# EasyEDA schematic T1_Schematic_RohanKumar_B24277.json
TITLE: Sheet_1; REV: 1.0; Date: 2025-07-06; Sheet: 1/1; Drawn By: rohankumar84342; Company: Your Company
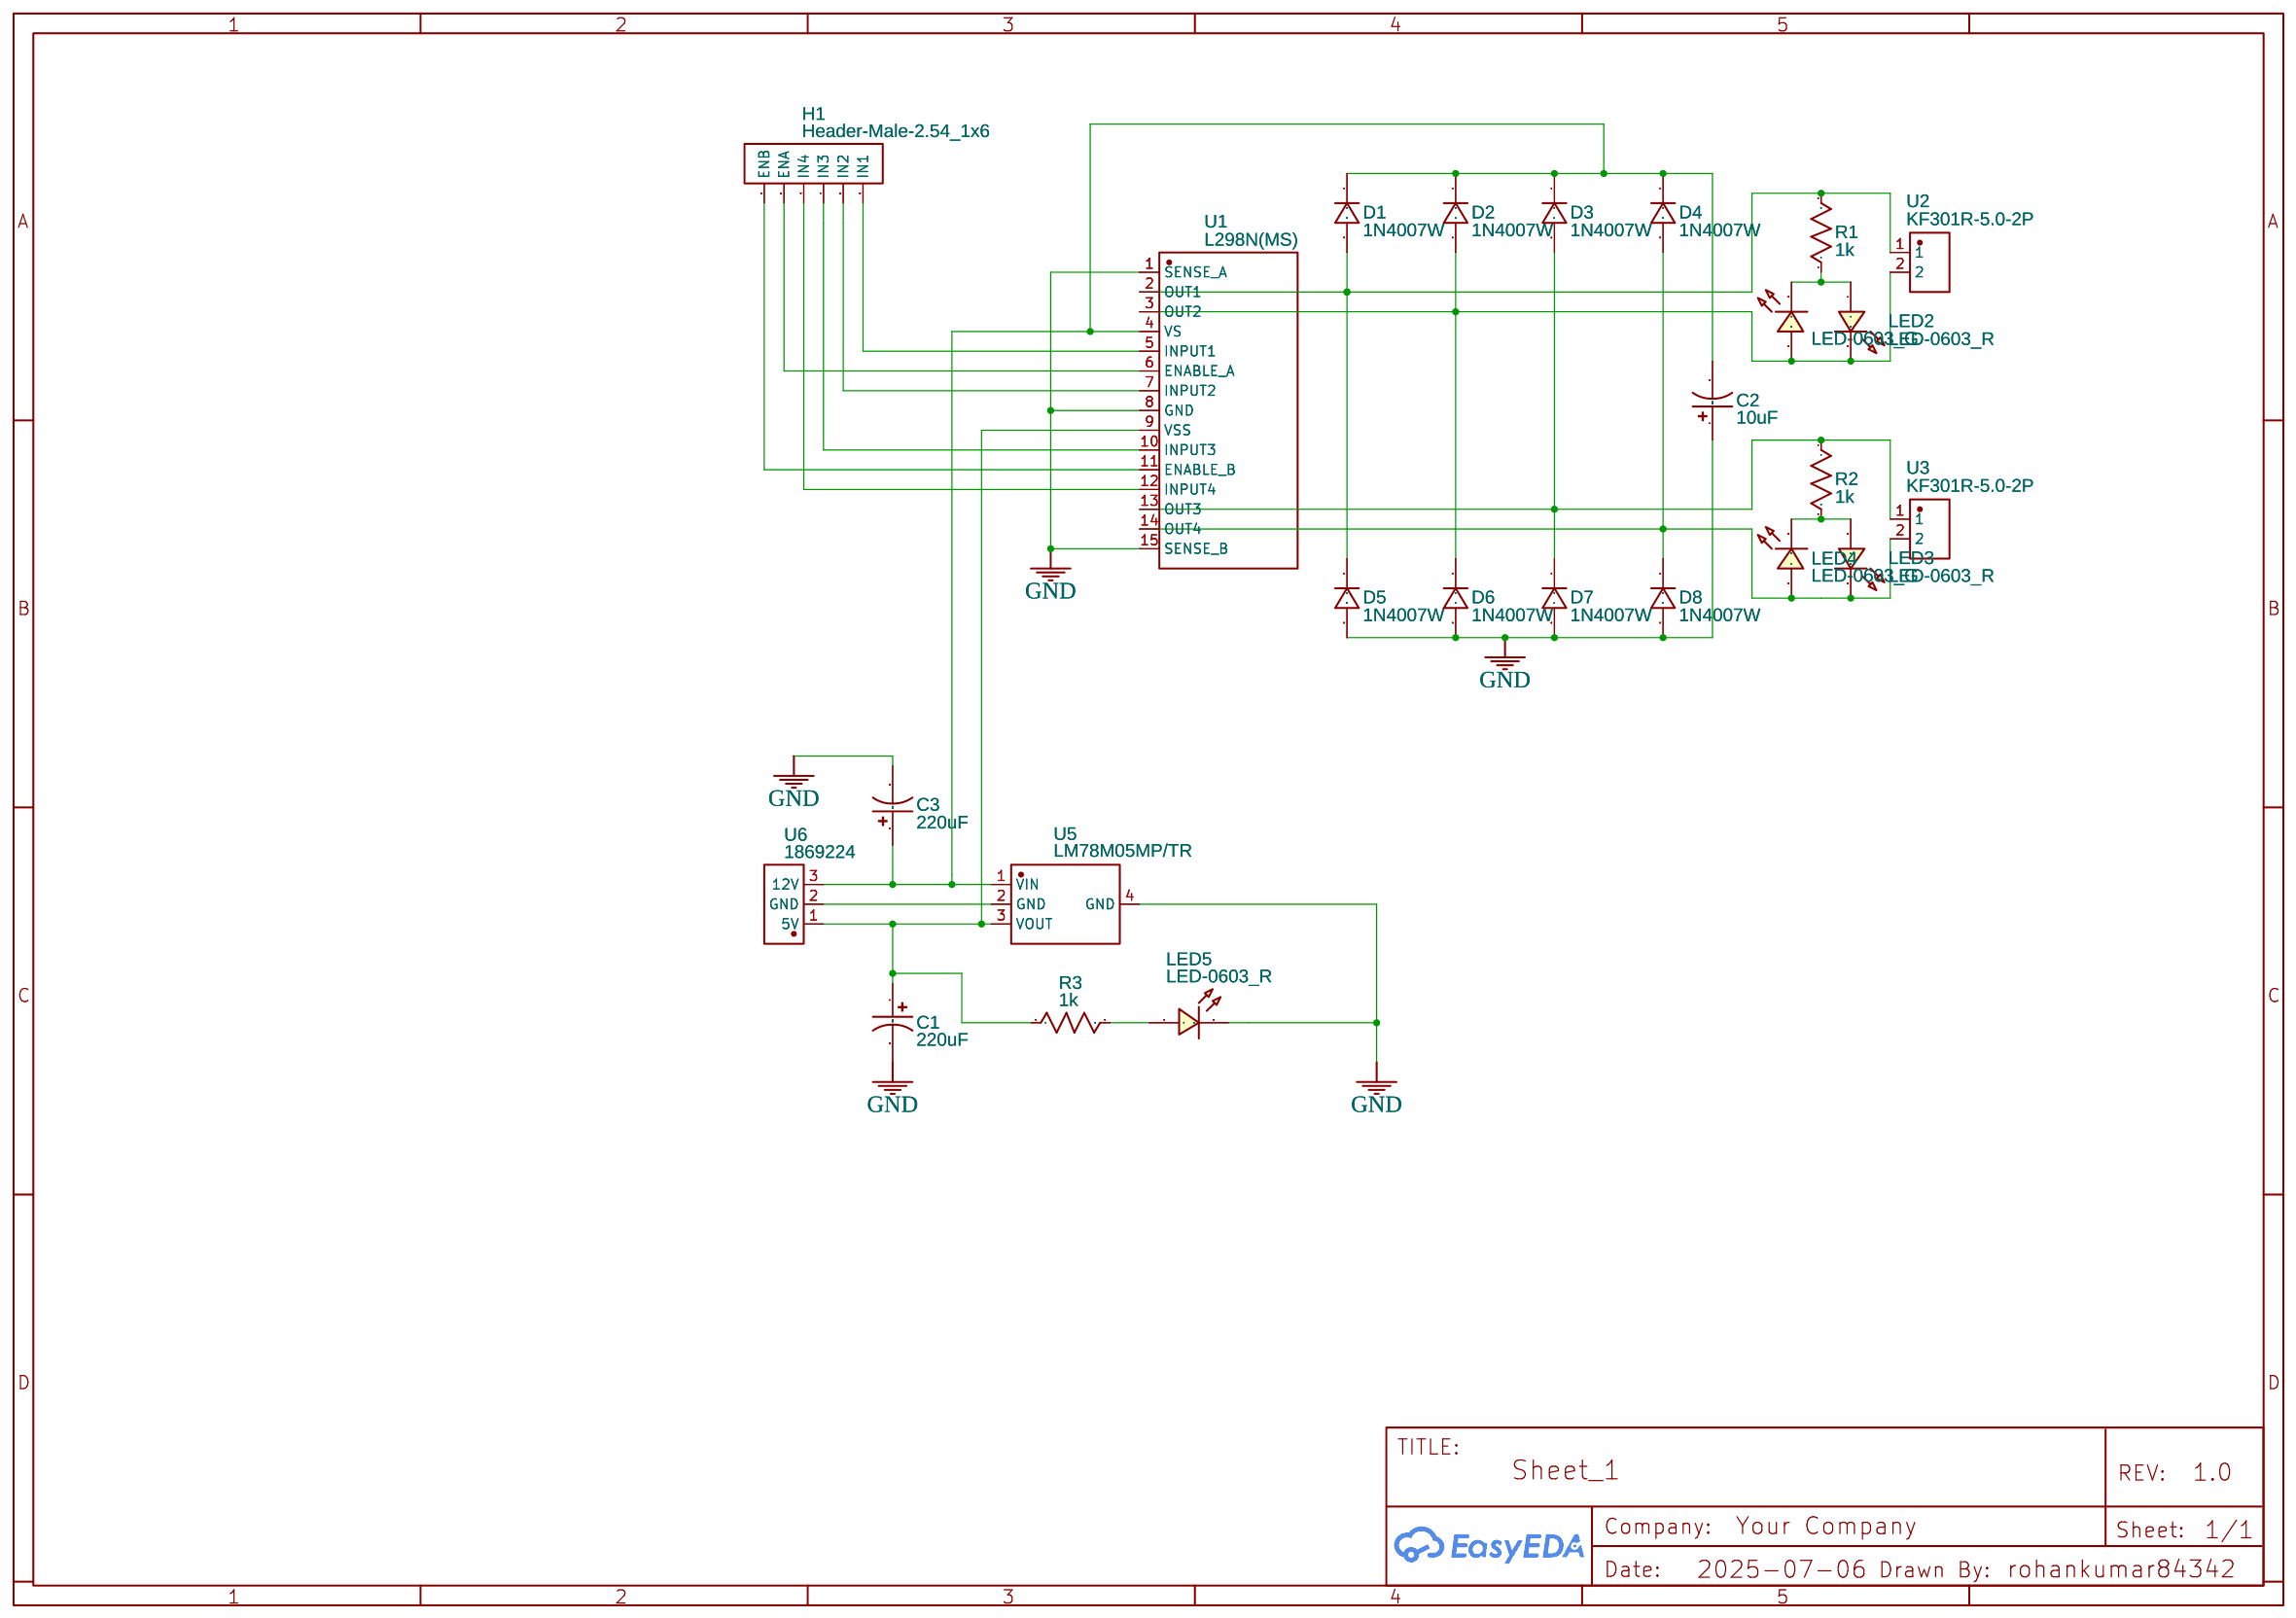
[diagram p0: schematic sheet]

## Parts
C1  220uF  [CASE-A_3216]
C2  10uF  [CASE-A_3216]
C3  220uF  [CASE-A_3216]
D1  1N4007W  [SOD-123_L2.8-W1.8-LS3.7-RD]
D2  1N4007W  [SOD-123_L2.8-W1.8-LS3.7-RD]
D3  1N4007W  [SOD-123_L2.8-W1.8-LS3.7-RD]
D4  1N4007W  [SOD-123_L2.8-W1.8-LS3.7-RD]
D5  1N4007W  [SOD-123_L2.8-W1.8-LS3.7-RD]
D6  1N4007W  [SOD-123_L2.8-W1.8-LS3.7-RD]
D7  1N4007W  [SOD-123_L2.8-W1.8-LS3.7-RD]
D8  1N4007W  [SOD-123_L2.8-W1.8-LS3.7-RD]
H1  Header-Male-2.54_1x6  [HDR-TH_6P-P2.54-V-M-1]
LED1  LED-0603_G  [LED0603_GREEN]
LED2  LED-0603_R  [LED0603_RED]
LED3  LED-0603_R  [LED0603_RED]
LED4  LED-0603_G  [LED0603_GREEN]
LED5  LED-0603_R  [LED0603_RED]
R1  1k  [R0603]
R2  1k  [R0603]
R3  1k  [R0603]
U1  L298N(MS)  [MULTIWATT-15_L19.6-W5.0-P1.27-L]
U2  KF301R-5.0-2P  [CONN-TH_P5.00_KF301R-5.0-2P]
U3  KF301R-5.0-2P  [CONN-TH_P5.00_KF301R-5.0-2P]
U5  LM78M05MP/TR  [SOT-223-4_L6.5-W3.5-P2.30-LS7.0-BR]
U6  1869224  [CONN-TH_3P-P5.08_1869224]

## Library data of the parts
C1-C3 = C_Tan_SMD_A_US: Contributor: LCEDA_Lib
D1-D8 = 1N4007W: Supplier: LCSC; Supplier Part: C328592; Manufacturer: BLUE ROCKET; Contributor: LCEDA_Lib
H1 = Header-Male-2.54_1x6: Supplier: LCSC; Manufacturer: BOOMELE(博穆精密); Manufacturer Part: 2.54-1x6P直针; Supplier Part: C37208; JLCPCB Part Class: Extended Part
LED1 LED4 = LED-0603_G: Manufacturer: EVERLIGHT(台湾亿光); Manufacturer Part: 19-217/GHC-YR1S2/3T; Supplier Part: C72043; Supplier: LCSC; Contributor: LCEDA_Lib
LED2 LED3 LED5 = LED-0603_R: Manufacturer: EVERLIGHT(台湾亿光); Manufacturer Part: 19-217/R6C-AL1M2VY/3T; Supplier Part: C72044; Supplier: LCSC; Contributor: LCEDA_01
R1-R3 = R_0603_US: Contributor: LCEDA_Lib
U1 = L298N(MS): Supplier: LCSC; Supplier Part: C19632282; Manufacturer: MSKSEMI(美森科); Contributor: lcsc; JLCPCB Part Class: Extended Part
U2 U3 = KF301R-5.0-2P: Contributor: LCSC; Supplier: LCSC; Supplier Part: C474883; Manufacturer: KEFA(科发); JLCPCB Part Class: Extended Part
U5 = LM78M05MP/TR: Supplier: LCSC; Supplier Part: C19193458; Manufacturer: HGSEMI(华冠); JLCPCB Part Class: Extended Part; Contributor: lcsc
U6 = 1869224: Supplier: LCSC; Supplier Part: C5490320; Manufacturer: Phoenix Contact(菲尼克斯); JLCPCB Part Class: Extended Part; Contributor: lcsc

## Nets
GND: C1.2 C2.1 C3.2 D5.2 D6.2 D7.2 D8.2 LED5.2 U1.1(SENSE A) U1.8(GND) U1.15(SENSE B) U5.4(GND)
Net-(C1-1): C1.1 R3.1 U1.9(VSS) U5.3(VOUT) U6.1(5V)
Net-(C2-2): C2.2 C3.1 D1.1 D2.1 D3.1 D4.1 U1.4(VS) U5.1(VIN) U6.3(12V)
Net-(D1-2): D1.2 D5.1 R1.2 U1.2(OUT1) U2.1
Net-(D2-2): D2.2 D6.1 LED1.1 LED2.2 U1.3(OUT2) U2.2
Net-(D3-2): D3.2 D7.1 R2.1 U1.13(OUT3) U3.1
Net-(D4-2): D4.2 D8.1 LED3.2 LED4.1 U1.14(OUT4) U3.2
Net-(H1-1): H1.1(ENB) U1.11(ENABLE B)
Net-(H1-2): H1.2(ENA) U1.6(ENABLE A)
Net-(H1-3): H1.3(IN4) U1.12(INPUT4)
Net-(H1-4): H1.4(IN3) U1.10(INPUT3)
Net-(H1-5): H1.5(IN2) U1.7(INPUT2)
Net-(H1-6): H1.6(IN1) U1.5(INPUT1)
Net-(LED1-2): LED1.2 LED2.1 R1.1
Net-(LED3-1): LED3.1 LED4.2 R2.2
Net-(LED5-1): LED5.1 R3.2
Net-(U5-2): U5.2(GND) U6.2(GND)
